# Altium project zero_shield.PrjPCB
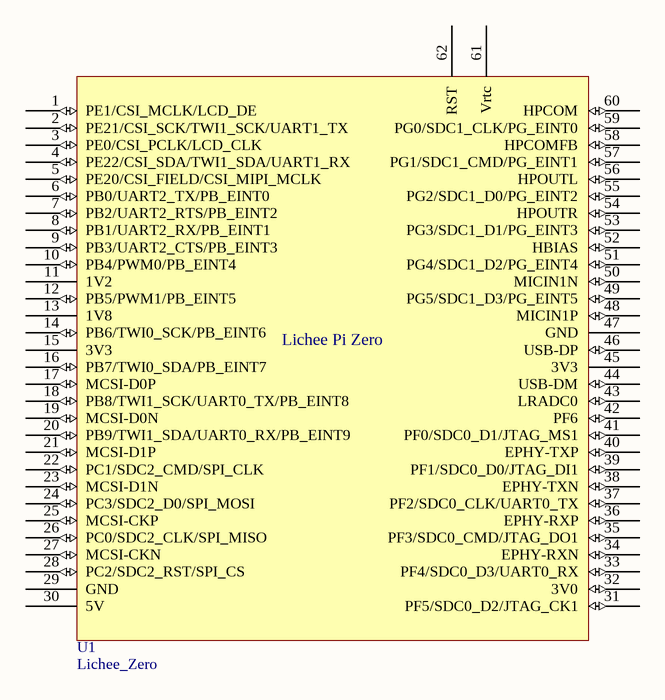
[diagram p0: zero_shield.SchDoc]
1 sheet, 1 parts. Net scope: global (net labels, ports and power ports of the same name join across sheets).
Board file: zero_shield.PcbDoc

## Sheet zero_shield.SchDoc
size A4

### Parts
U1  Lichee_Zero  [Lichee_Zero_Half]

### Nets

Not connected (* = marked no-connect by the designer): U1 1(PE1/CSI_MCLK/LCD_DE) 2(PE21/CSI_SCK/TWI1_SCK/UART1_TX) 3(PE0/CSI_PCLK/LCD_CLK) 4(PE22/CSI_SDA/TWI1_SDA/UART1_RX) 5(PE20/CSI_FIELD/CSI_MIPI_MCLK) 6(PB0/UART2_TX/PB_EINT0) 7(PB2/UART2_RTS/PB_EINT2) 8(PB1/UART2_RX/PB_EINT1) 9(PB3/UART2_CTS/PB_EINT3) 10(PB4/PWM0/PB_EINT4) 11(1V2) 12(PB5/PWM1/PB_EINT5) 13(1V8) 14(PB6/TWI0_SCK/PB_EINT6) 15(3V3) 16(PB7/TWI0_SDA/PB_EINT7) 17(MCSI-D0P) 18(PB8/TWI1_SCK/UART0_TX/PB_EINT8) 19(MCSI-D0N) 20(PB9/TWI1_SDA/UART0_RX/PB_EINT9) 21(MCSI-D1P) 22(PC1/SDC2_CMD/SPI_CLK) 23(MCSI-D1N) 24(PC3/SDC2_D0/SPI_MOSI) 25(MCSI-CKP) 26(PC0/SDC2_CLK/SPI_MISO) 27(MCSI-CKN) 28(PC2/SDC2_RST/SPI_CS) 29(GND) 30(5V) 31(PF5/SDC0_D2/JTAG_CK1) 32(3V0) 33(PF4/SDC0_D3/UART0_RX) 34(EPHY-RXN) 35(PF3/SDC0_CMD/JTAG_DO1) 36(EPHY-RXP) 37(PF2/SDC0_CLK/UART0_TX) 38(EPHY-TXN) 39(PF1/SDC0_D0/JTAG_DI1) 40(EPHY-TXP) 41(PF0/SDC0_D1/JTAG_MS1) 42(PF6) 43(LRADC0) 44(USB-DM) 45(3V3) 46(USB-DP) 47(GND) 48(MICIN1P) 49(PG5/SDC1_D3/PG_EINT5) 50(MICIN1N) 51(PG4/SDC1_D2/PG_EINT4) 52(HBIAS) 53(PG3/SDC1_D1/PG_EINT3) 54(HPOUTR) 55(PG2/SDC1_D0/PG_EINT2) 56(HPOUTL) 57(PG1/SDC1_CMD/PG_EINT1) 58(HPCOMFB) 59(PG0/SDC1_CLK/PG_EINT0) 60(HPCOM) 61(Vrtc) 62(RST)

### Notes on the sheet
- (in symbol Lichee_Zero_Half) Lichee Pi Zero

### Library data of the parts
U1 = Lichee_Zero_Half